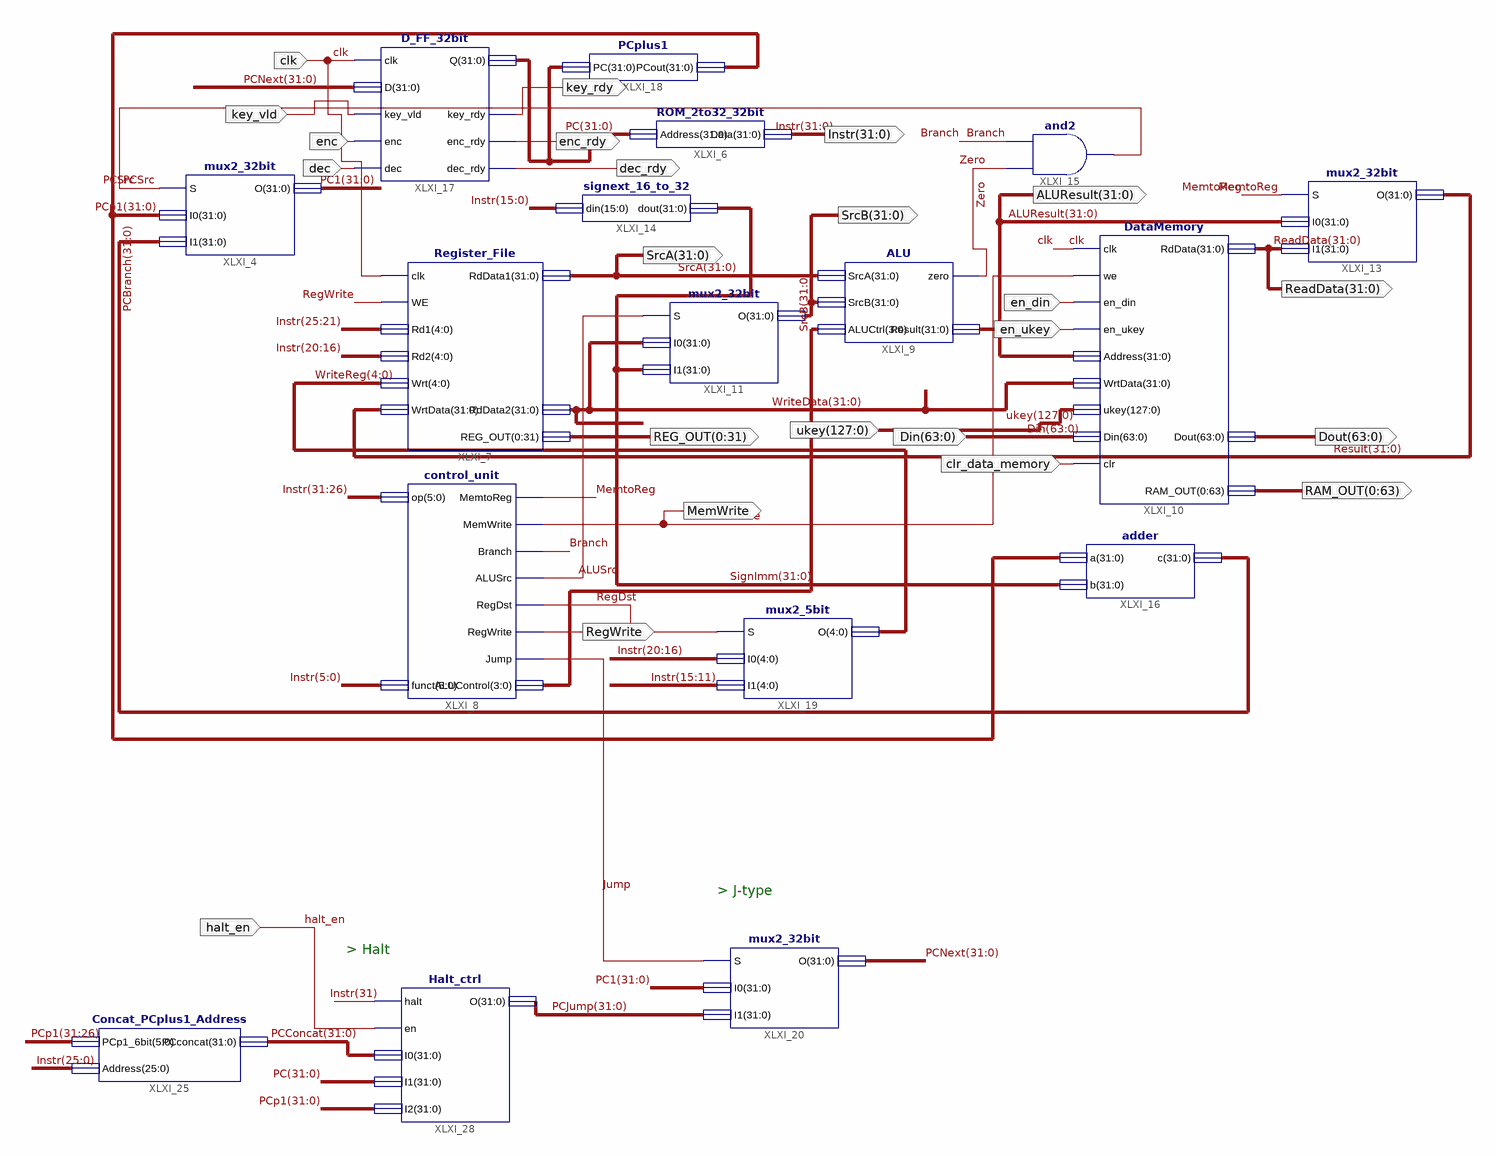
[diagram p0: schematic sheet 1]
// Xilinx ISE schematic top_schematic.sch (artix7) as structural Verilog: 17 symbols, 23 ports
module top_schematic (
  input  clk,
  input  halt_en,
  input  [127:0] ukey,
  input  [63:0] Din,
  input  en_din,
  input  en_ukey,
  input  clr_data_memory,
  input  enc,
  input  dec,
  input  key_vld,
  output [31:0] Instr,
  output RegWrite,
  output [31:0] SrcA,
  output [31:0] SrcB,
  output MemWrite,
  output [31:0] ReadData,
  output [31:0] ALUResult,
  output [63:0] Dout,
  output [0:63] RAM_OUT,
  output [0:31] REG_OUT,
  output key_rdy,
  output enc_rdy,
  output dec_rdy
);

  wire ALUSrc, Branch, Jump, MemtoReg, PCSrc, RegDst, Zero;
  wire [3:0] XLXN_17;
  wire [4:0] WriteReg;
  wire [31:0] PC, PC1, PCBranch, PCConcat, PCJump, PCNext, PCp1, Result, SignImm, WriteData;

  mux2_32bit XLXI_4 (.S(PCSrc), .I0(PCp1), .I1(PCBranch), .O(PC1));
  ROM_2to32_32bit XLXI_6 (.Address(PC), .Data(Instr));
  Register_File XLXI_7 (
    .clk(clk), .WE(RegWrite), .Rd1(Instr[25:21]), .Rd2(Instr[20:16]), .Wrt(WriteReg), .WrtData(Result),
    .RdData1(SrcA), .RdData2(WriteData), .REG_OUT(REG_OUT));
  control_unit XLXI_8 (
    .op(Instr[31:26]), .funct(Instr[5:0]), .MemtoReg(MemtoReg), .MemWrite(MemWrite), .Branch(Branch),
    .ALUSrc(ALUSrc), .RegDst(RegDst), .RegWrite(RegWrite), .Jump(Jump), .ALUControl(XLXN_17));
  ALU XLXI_9 (.SrcA(SrcA), .SrcB(SrcB), .ALUCtrl(XLXN_17), .zero(Zero), .Result(ALUResult));
  DataMemory XLXI_10 (
    .clk(clk), .we(MemWrite), .en_din(en_din), .en_ukey(en_ukey), .clr(clr_data_memory), .Address(ALUResult),
    .WrtData(WriteData), .ukey(ukey), .Din(Din), .RdData(ReadData), .Dout(Dout), .RAM_OUT(RAM_OUT));
  mux2_32bit XLXI_11 (.S(ALUSrc), .I0(WriteData), .I1(SignImm), .O(SrcB));
  mux2_32bit XLXI_13 (.S(MemtoReg), .I0(ALUResult), .I1(ReadData), .O(Result));
  signext_16_to_32 XLXI_14 (.din(Instr[15:0]), .dout(SignImm));
  and XLXI_15 (PCSrc, Zero, Branch);
  adder XLXI_16 (.a(PCp1), .b(SignImm), .c(PCBranch));
  D_FF_32bit XLXI_17 (
    .clk(clk), .D(PCNext), .Q(PC), .key_vld(key_vld), .enc(enc), .dec(dec), .key_rdy(key_rdy),
    .enc_rdy(enc_rdy), .dec_rdy(dec_rdy));
  PCplus1 XLXI_18 (.PC(PC), .PCout(PCp1));
  mux2_5bit XLXI_19 (.S(RegDst), .I0(Instr[20:16]), .I1(Instr[15:11]), .O(WriteReg));
  mux2_32bit XLXI_20 (.S(Jump), .I0(PC1), .I1(PCJump), .O(PCNext));
  Concat_PCplus1_Address XLXI_25 (.PCp1_6bit(PCp1[31:26]), .Address(Instr[25:0]), .PCconcat(PCConcat));
  Halt_ctrl XLXI_28 (.halt(Instr[31]), .en(halt_en), .I0(PCConcat), .I1(PC), .I2(PCp1), .O(PCJump));

  // Notes on the sheet:
  //   > J-type
  //   > Halt
endmodule
